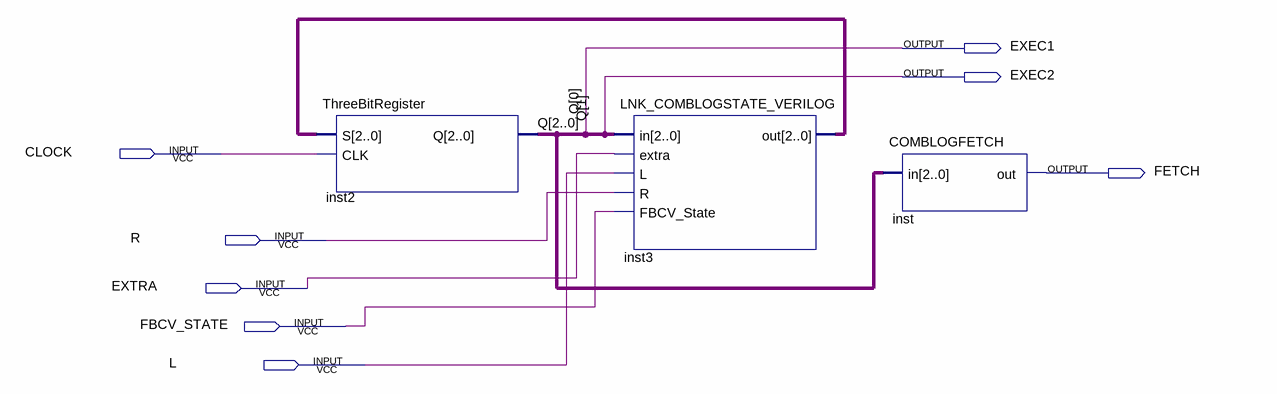
[diagram p0: schematic sheet]
// Quartus schematic LNK_RND_FBCV_Project_StateMachine_V1.bdf as structural Verilog: 3 symbols, 8 pins
module LNK_RND_FBCV_Project_StateMachine_V1 (
  input  CLOCK,
  input  R,
  input  EXTRA,
  input  FBCV_STATE,
  input  L,
  output EXEC1,
  output EXEC2,
  output FETCH
);

  wire [2:0] inst3_out;
  wire [2:2] Q;

  ThreeBitRegister inst2 (.S(inst3_out), .CLK(CLOCK), .Q({Q[2], EXEC2, EXEC1}));
  LNK_COMBLOGSTATE_VERILOG inst3 (
    .in({Q[2], EXEC2, EXEC1}), .extra(EXTRA), .L(L), .R(R), .FBCV_State(FBCV_STATE), .out(inst3_out));
  COMBLOGFETCH inst (.in({Q[2], EXEC2, EXEC1}), .out(FETCH));

  // Other names for the same wires on the sheet: Q[1:0] = {EXEC2, EXEC1}
endmodule
